# EAGLE design Sens_BMP085 (EAGLE 6.3)
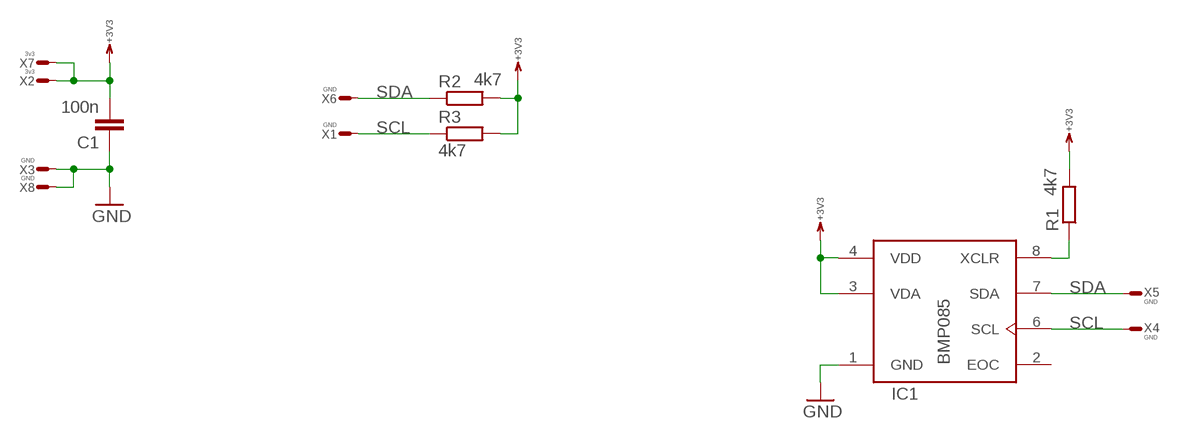
[diagram p0: schematic, sheet 1]

## Parts
C1  100n  C0603  [0603]
IC1  BMP085  [LCC8]
R1  4k7  R0603  [0603]
R2  4k7  R0603  [0603]
R3  4k7  R0603  [0603]
X1  GND  WIREPADT1.6/0.9  [T1.6/0.9]
X2  3v3  WIREPADT1.6/0.9  [T1.6/0.9]
X3  GND  WIREPADT1.6/0.9  [T1.6/0.9]
X4  GND  WIREPADT1.6/0.9  [T1.6/0.9]
X5  GND  WIREPADT1.6/0.9  [T1.6/0.9]
X6  GND  WIREPADT1.6/0.9  [T1.6/0.9]
X7  3v3  WIREPADT1.6/0.9  [T1.6/0.9]
X8  GND  WIREPADT1.6/0.9  [T1.6/0.9]

## Nets
+3V3: C1.2 IC1.3(VDA) IC1.4(VDD) R1.2 R2.2 R3.2 X2.1(S) X7.1(S)
GND: C1.1 IC1.1(GND) X3.1(S) X8.1(S)
N$2: IC1.8(XCLR) R1.1
SCL: IC1.6(SCL) R3.1 X1.1(S) X4.1(S)
SDA: IC1.7(SDA) R2.1 X5.1(S) X6.1(S)
Unconnected: IC1.2(EOC)

## Library data of the parts
C1 = RCL:C: Capacitor SMD
IC1 = Sensors:BMP085
R1-R3 = RCL:R: Resistor SMD
X1-X8 = Conn:WIREPAD: Wire PAD connect wire on PCB

## Board
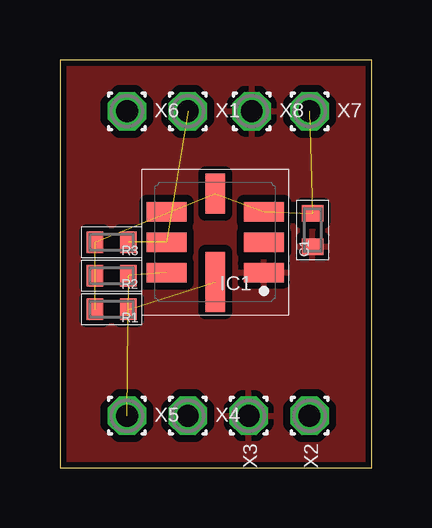
[diagram p1: board, top side]
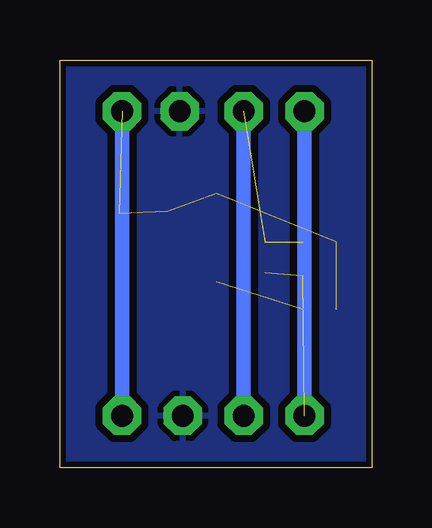
[diagram p2: board, bottom side, seen from below]

Size 13 x 17 mm. Coordinates in mm from the lower left corner, seen from the top.
Outline: 0,0 13,0 13,17 0,17 0,0
Copper layers (1*16): Top 0.035mm / dielectric 1.5mm / Bottom 0.035mm
Design rules "default *": minimum track width 10mil, minimum drill 12mil, track to track 12mil, track to pad 12mil, pad to pad 12mil, via to via 12mil, smd to smd 12mil, copper to edge 10mil, drill to drill 8mil, minimum pad ring 10mil, minimum via ring 8mil, stop-mask expansion 4mil, vias tented up to drill 0mil, thermal gap 10mil
tRestrict: area 2.4,7.4 to 3.2,8.1

### Footprints (pad centres in the part's own frame; a part is rotated, then mirrored left to right if it is on the bottom)
0603 = smd 0.7 x 0.9: 1 -0.697,0; 2 0.697,0
LCC8 = smd 1.67 x 0.8: 1 -2.032,1.27; 2 -2.032,0; 3 -2.032,-1.27; 5 2.032,-1.27; 6 2.032,0; 7 2.032,1.27 | smd 0.8 x 1.67: 4 0,-2.032 | smd 0.8 x 2.5: 8 0,1.651
T1.6/0.9 = drill 0.914 pad 1.6 octagon: 1 0,0

### Placement (x,y rotation side)
C1  10.54,9.91 90 top
IC1  6.48,9.4 180 top
R1  2.16,6.6 180 top
R2  2.16,8 180 top
R3  2.16,9.4 180 top
X1  5.33,14.86 0 top
X2  10.41,2.16 270 top
X3  7.87,2.16 270 top
X4  5.33,2.16 0 top
X5  2.79,2.16 0 top
X6  2.79,14.86 0 top
X7  10.41,14.86 0 top
X8  8,14.86 0 top

### Tracks (layer width: path | path; a pad name or v marks a point on that pad's centre or on a via)
+3V3  (6 unrouted)
  Bottom 0.61: X7.1 X2.1
GND
  pour Top: 0,17 13,17 13,0 0,0
  pour Bottom: 0,0 13,0 13,17 0,17
N$2  (1 unrouted)
SCL  (2 unrouted)
  Bottom 0.61: X4.1 X1.1
SDA  (2 unrouted)
  Bottom 0.61: X5.1 X6.1